# EAGLE design string_lights_revA (EAGLE 7.3.0)
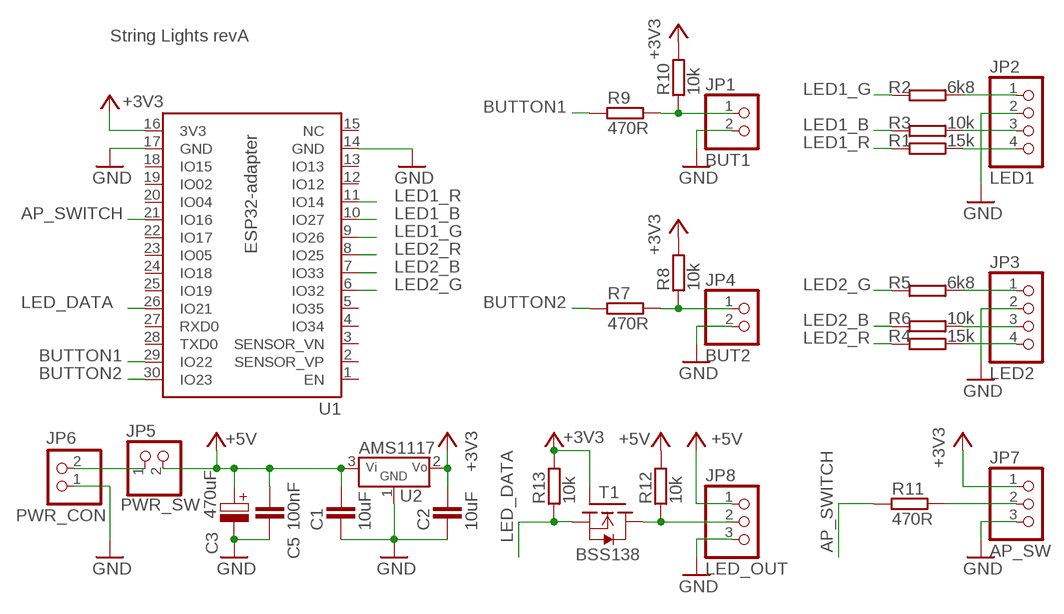
[diagram p0: schematic, sheet 1]

## Parts
C1  10uF  C-CERAMIC'SMD'  [C0805]
C2  10uF  C-CERAMIC'SMD'  [C0805]
C3  470uF  C-POLY'10MM'  [ELYT-10MM]
C5  100nF  C-CERAMIC'SMD'  [C0805]
JP1  BUT1  PINHD-1X2/90  [1X02/90]
JP2  LED1  PINHD-1X4/90  [1X04/90]
JP3  LED2  PINHD-1X4/90  [1X04/90]
JP4  BUT2  PINHD-1X2/90  [1X02/90]
JP5  PWR_SW  PINHD-1X2/90  [1X02/90]
JP6  PWR_CON  PINHD-1X2/90  [1X02/90]
JP7  AP_SW  PINHD-1X3/90  [1X03/90]
JP8  LED_OUT  PINHD-1X3/90  [1X03/90]
R1  15k  R'2'  [R0805]
R2  6k8  R'2'  [R0805]
R3  10k  R'2'  [R0805]
R4  15k  R'2'  [R0805]
R5  6k8  R'2'  [R0805]
R6  10k  R'2'  [R0805]
R7  470R  R'2'  [R0805]
R8  10k  R'2'  [R0805]
R9  470R  R'2'  [R0805]
R10  10k  R'2'  [R0805]
R11  470R  R'2'  [R0805]
R12  10k  R'2'  [R0805]
R13  10k  R'2'  [R0805]
T1  BSS138  [SOT23]
U1  ESP32-ADAPTER  [ESP32-ADAPTER]
U2  AMS1117  V_STAB'TS1117'  [SOT223]

## Nets
+3V3: C2.2 JP7.1 R8.2 R10.2 R13.2 T1.1(G) U1.16(3V3) U2.2(VOUT)
+5V: C1.2 C3.P(POS) C5.2 JP5.2 JP8.1 R12.2 U2.3(VIN)
AP_SWITCH: R11.1 U1.21(IO16)
BUTTON1: R9.1 U1.29(IO22)
BUTTON2: R7.1 U1.30(IO23)
GND: C1.1 C2.1 C3.N(NEG) C5.1 JP1.2 JP2.2 JP3.2 JP4.2 JP6.1 JP7.3 JP8.3 U1.14(GND) U1.17(GND) U2.1(GND)
LED1_B: R3.1 U1.10(IO27)
LED1_G: R2.1 U1.9(IO26)
LED1_R: R1.1 U1.11(IO14)
LED2_B: R6.1 U1.7(IO33)
LED2_G: R5.1 U1.6(IO32)
LED2_R: R4.1 U1.8(IO25)
LED_DATA: R13.1 T1.2(S) U1.26(IO21)
N$1: JP5.1 JP6.2
N$2: JP2.4 R1.2
N$3: JP2.3 R3.2
N$4: JP2.1 R2.2
N$5: JP3.1 R5.2
N$6: JP3.3 R6.2
N$7: JP3.4 R4.2
N$8: JP4.1 R7.2 R8.1
N$9: JP1.1 R9.2 R10.1
N$10: JP7.2 R11.2
N$12: JP8.2 R12.1 T1.3(D)
Unconnected: U1.1(EN) U1.2(SENSOR_VP) U1.3(SENSOR_VN) U1.4(IO34) U1.5(IO35) U1.12(IO12) U1.13(IO13) U1.15(NC) U1.18(IO15) U1.19(IO02) U1.20(IO04) U1.22(IO17) U1.23(IO05) U1.24(IO18) U1.25(IO19) U1.27(RXD0) U1.28(TXD0)

## Notes on the sheet
- String Lights revA

## Library data of the parts
C1 C2 C5 = 1_domaci:C-CERAMIC
C3 = 1_domaci:C-POLY
JP1 JP4-JP6 = pinhead:PINHD-1X2: PIN HEADER
JP2 JP3 = pinhead:PINHD-1X4: PIN HEADER
JP7 JP8 = pinhead:PINHD-1X3: PIN HEADER
R1-R13 = 1_domaci:R
T1 = 1_domaci:BSS138
U1 = 1_domaci:ESP32-ADAPTER
U2 = 1_domaci:V_STAB

## Board
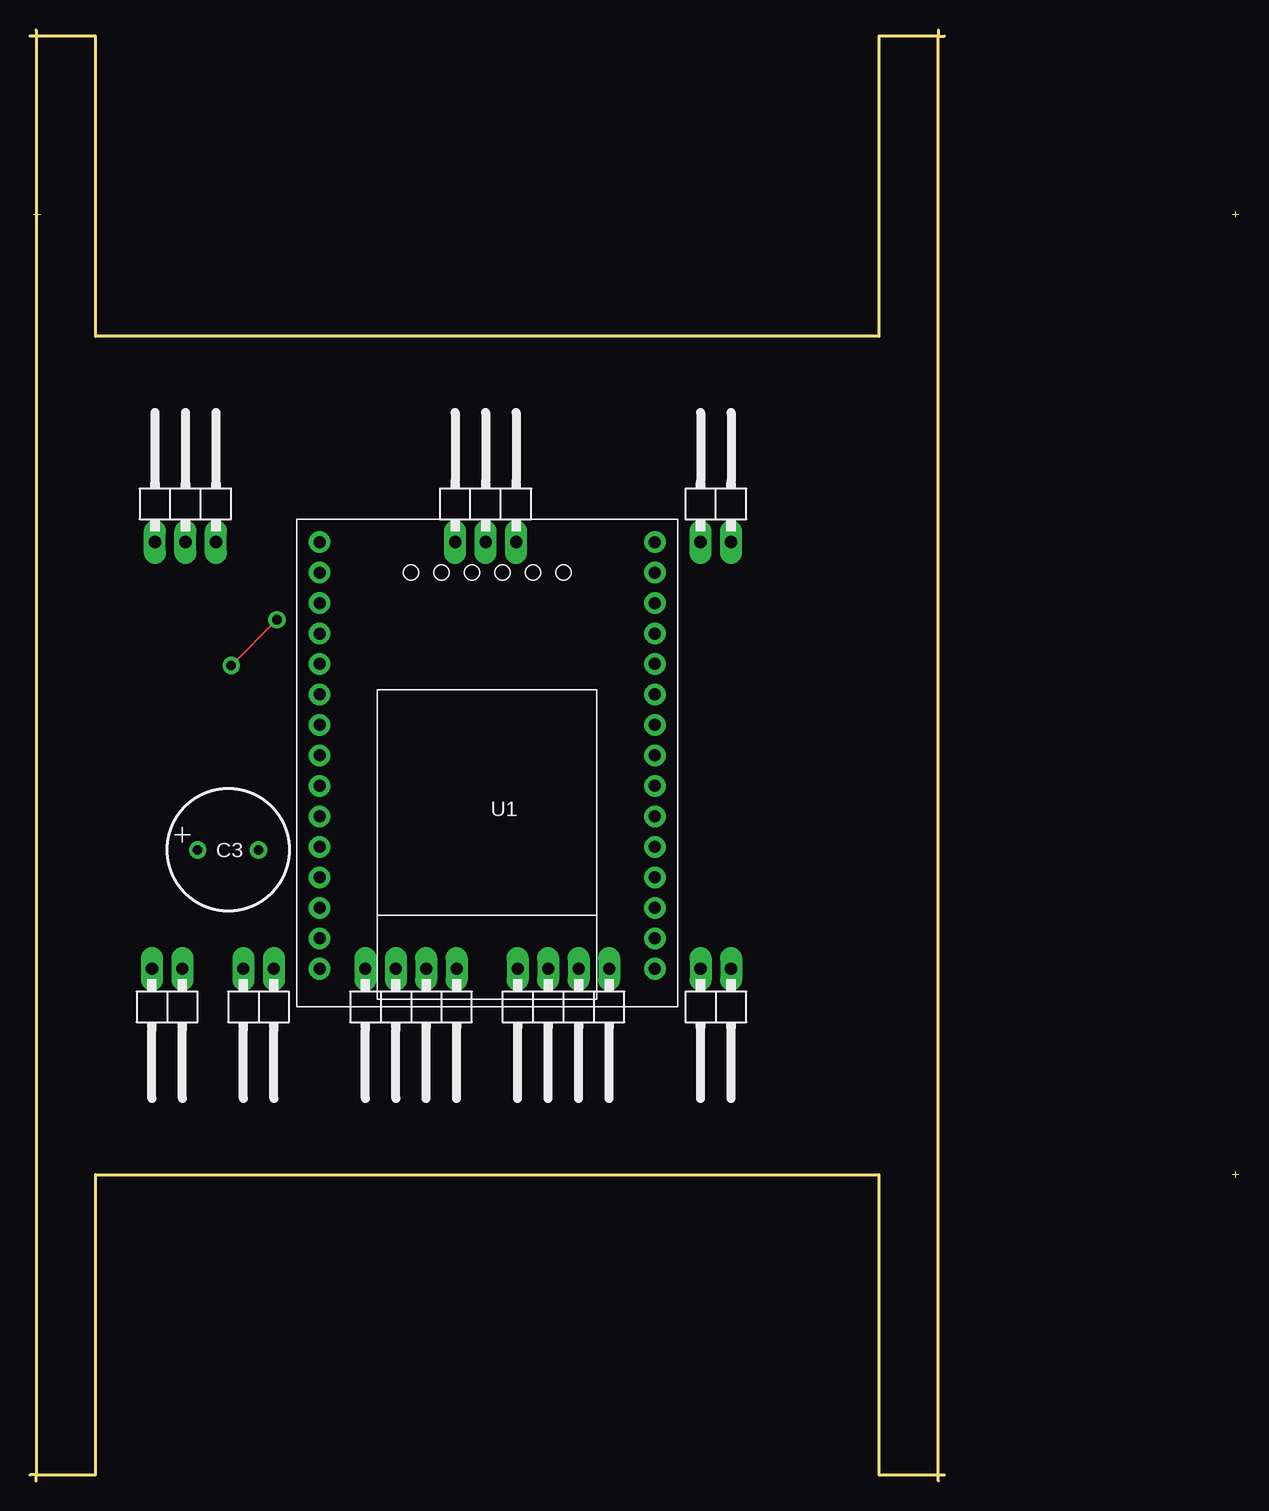
[diagram p1: board, top side]
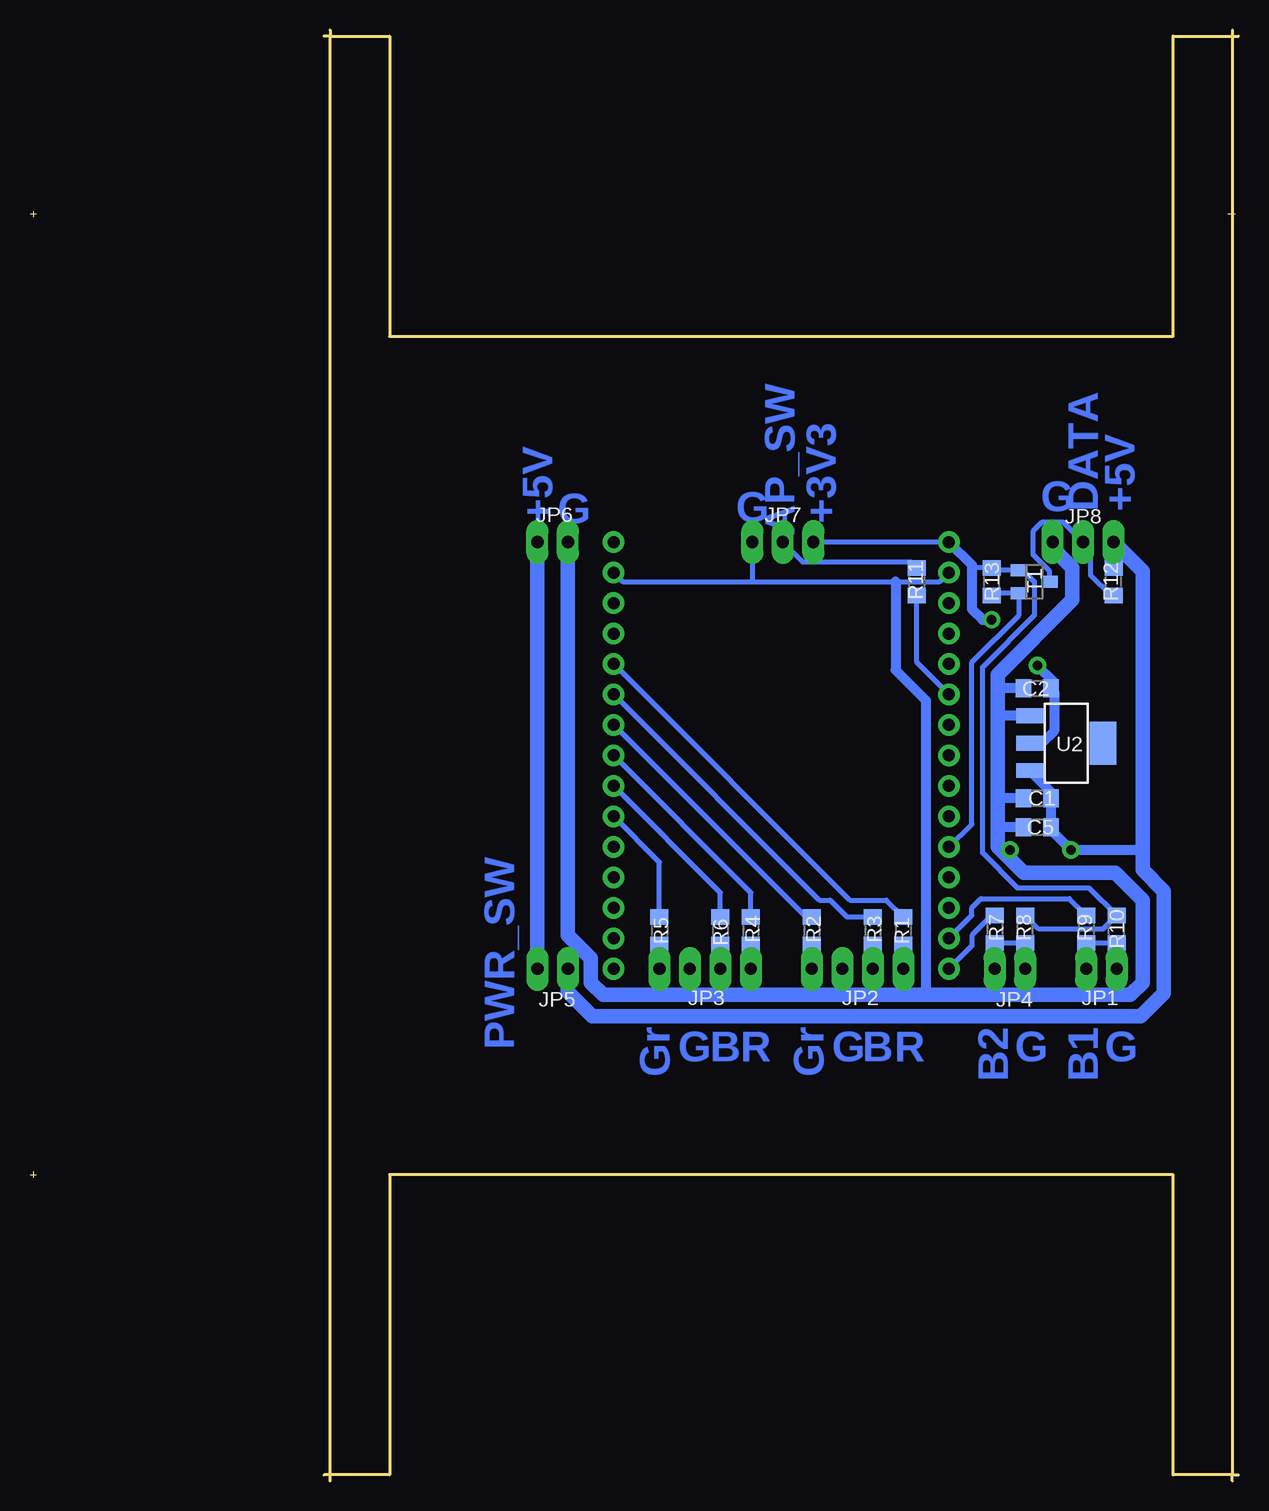
[diagram p2: board, bottom side, seen from below]

Size 100.71 x 120.9 mm. Coordinates in mm from the lower left corner, seen from the top.
Outline: 75.69,0.51 75.69,120.4
Outline: 0.51,120.4 0.51,0.51
Outline: 0.51,0.51 5.46,0.51 5.46,25.53 70.74,25.53 70.74,0.51 75.69,0.51
Outline: 0.51,120.4 5.46,120.4 5.46,95.38 70.74,95.38 70.74,120.4 75.69,120.4
Outline: 100.2,105.54 100.71,105.54
Outline: 100.46,105.79 100.46,105.28
Outline: 100.46,25.78 100.46,25.27
Outline: 100.71,25.53 100.2,25.53
Outline: 0.25,105.54 0.89,105.54
Outline: 0.51,120.4 0,120.4
Outline: 0.51,120.9 0.51,120.4
Outline: 75.69,120.9 75.69,120.4
Outline: 75.69,120.4 76.2,120.4
Outline: 75.69,0.51 76.2,0.51
Outline: 75.69,0 75.69,0.51
Outline: 0.51,0 0.51,0.51
Outline: 0.51,0.51 0,0.51
Copper layers (1*16): Top 0.035mm / dielectric 1.5mm / Bottom 0.035mm
Design rules "default *": minimum track width 10mil, minimum drill 24mil, track to track 8mil, track to pad 8mil, pad to pad 8mil, via to via 8mil, smd to smd 8mil, copper to edge 40mil, drill to drill 8mil, minimum pad ring 10mil, minimum via ring 8mil, stop-mask expansion 4mil, vias tented up to drill 0mil, thermal gap 10mil

### Footprints (pad centres in the part's own frame; a part is rotated, then mirrored left to right if it is on the bottom)
C0805 = smd 1.3 x 1.5: 1 -1.143,0; 2 1.143,0
ELYT-10MM = drill 0.8: N 2.54,0; P -2.54,0
1X02/90 = drill 1.016 long: 1 -1.27,-3.81; 2 1.27,-3.81
1X04/90 = drill 1.016 long: 1 -3.81,-3.81; 2 -1.27,-3.81; 3 1.27,-3.81; 4 3.81,-3.81
1X03/90 = drill 1.016 long: 1 -2.54,-3.81; 2 0,-3.81; 3 2.54,-3.81
R0805 = smd 1.3 x 1.5: 1 -1.143,0; 2 1.143,0
SOT23 = smd 1 x 1.4: 1 -0.953,-1.27; 2 0.953,-1.27; 3 0,1.27
ESP32-ADAPTER = drill 1: 1 -13.97,17.78; 2 -13.97,15.24; 3 -13.97,12.7; 4 -13.97,10.16; 5 -13.97,7.62; 6 -13.97,5.08; 7 -13.97,2.54; 8 -13.97,0; 9 -13.97,-2.54; 10 -13.97,-5.08; 11 -13.97,-7.62; 12 -13.97,-10.16; 13 -13.97,-12.7; 14 -13.97,-15.24; 15 -13.97,-17.78; 16 13.97,-17.78; 17 13.97,-15.24; 18 13.97,-12.7; 19 13.97,-10.16; 20 13.97,-7.62; 21 13.97,-5.08; 22 13.97,-2.54; 23 13.97,0; 24 13.97,2.54; 25 13.97,5.08; 26 13.97,7.62; 27 13.97,10.16; 28 13.97,12.7; 29 13.97,15.24; 30 13.97,17.78
SOT223 = smd 1.219 x 2.235: 1 -2.286,-3.048; 2 0,-3.048; 3 2.286,-3.048 | smd 3.6 x 2.2: 4 0,3.048

### Placement (x,y rotation side)
C1  16.76,56.9 0 bottom
C2  16.76,66.04 0 bottom
C3  16.51,52.58 0 top
C5  16.76,54.48 0 bottom
JP1  11.43,38.86 180 top
JP2  31.75,38.86 180 top
JP3  44.45,38.86 180 top
JP4  19.05,38.86 180 top
JP5  57.15,38.86 180 top
JP6  57.15,82.04 0 top
JP7  37.97,82.04 0 top
JP8  12.95,82.04 0 top
R1  27.94,45.85 270 bottom
R2  35.56,45.85 270 bottom
R3  30.48,45.85 270 bottom
R4  40.64,45.85 270 bottom
R5  48.26,45.85 270 bottom
R6  43.18,45.85 270 bottom
R7  20.32,45.97 270 bottom
R8  17.78,45.97 90 bottom
R9  12.7,45.97 270 bottom
R10  10.16,45.97 90 bottom
R11  26.8,74.93 90 bottom
R12  10.41,74.93 90 bottom
R13  20.57,74.93 90 bottom
T1  17.02,74.93 270 bottom
U1  38.1,60.45 180 top
U2  14.35,61.47 270 bottom

### Tracks (layer width: path | path; a pad name or v marks a point on that pad's centre or on a via)
+3V3  (via drill 0.8)
  Top 0.127: v16.76,67.94 v20.57,71.75
  Bottom 0.406: U1.16 JP7.1 | R8.2 16.64,45.97 11.3,45.97 R10.2 12.45,49.4 18.41,49.4 21.34,52.32 21.34,67.82 17.02,72.14 17.02,74.93 17.97,75.88 T1.1 20.38,75.88 R13.2 22.22,76.07
  Bottom 0.813: v16.76,67.94 15.37,66.55 15.37,66.04 C2.2 15.37,65.79 15.37,62.48 16.38,61.47 U2.2 | U1.16 22.22,76.33 22.22,76.07 22.22,72.64 21.34,71.75 v20.57,71.75
+5V
  Bottom 0.406: R12.2 9.33,77.15
  Bottom 0.813: U2.3 15.62,57.4 C1.2 C5.2 15.62,54.23 C3.P 8,52.58
  Bottom 1.219: JP5.2 55.88,40.77 53.85,38.73 8.13,38.73 6.22,40.64 6.22,49.15 8,50.93 8,52.58 8,75.82 9.33,77.15 JP8.1
AP_SWITCH
  Bottom 0.406: U1.21 26.8,68.2 R11.1
BUTTON1
  Bottom 0.406: U1.29 22.22,47.12 22.22,47.75 21.46,48.51 14.1,48.51 R9.1
BUTTON2
  Bottom 0.406: R7.1 20.57,47.12 22.22,45.47 22.22,44.58 U1.30
GND
  Bottom 0.406: U1.14 51.31,74.93 40.51,74.93 | 40.51,74.93 28.57,74.93 24.89,74.93 U1.17 | JP7.3 40.51,74.93 | JP1.2 10.16,40.51 | JP4.2 17.78,40.51 | JP2.2 33.02,40.51 | JP3.2 45.72,40.51
  Bottom 0.813: 26.04,40.51 26.04,65.02 28.57,67.56 28.57,74.93 | C1.1 20.07,56.9 | C5.1 20.07,54.48 | C2.1 20.07,66.04 | U2.1 20.07,63.75 | C3.N 19.43,52.2
  Bottom 1.219: JP6.1 55.88,45.47 53.98,43.56 53.98,41.53 52.96,40.51 45.72,40.51 33.02,40.51 26.04,40.51 17.78,40.51 10.16,40.51 9.02,40.51 8,41.53 8,48.39 10.29,50.67 17.91,50.67 19.43,52.2 20.07,52.83 20.07,54.48 20.07,56.9 20.07,63.75 20.07,66.04 20.07,67.18 13.84,73.41 13.84,76.07 15.49,77.72 JP8.3
LED1_B
  Bottom 0.406: U1.10 34.93,48.39 34.04,48.39 32.64,46.99 R3.1
LED1_G
  Bottom 0.406: R2.1 36.07,46.99 U1.9
LED1_R
  Bottom 0.406: U1.11 32.38,48.39 29.34,48.39 R1.1
LED2_B
  Bottom 0.406: R6.1 43.18,49.02 U1.7
LED2_G
  Bottom 0.406: R5.1 48.26,51.56 U1.6
LED2_R
  Bottom 0.406: R4.1 40.64,49.02 U1.8
LED_DATA
  Bottom 0.406: U1.26 22.22,54.74 22.22,68.2 18.29,72.14 T1.2 20.38,73.98 R13.1
N$1
  Bottom 1.219: JP6.2 JP5.1
N$2
  Bottom 0.406: JP2.4 R1.2
N$3
  Bottom 0.406: JP2.3 R3.2
N$4
  Bottom 0.406: JP2.1 R2.2
N$5
  Bottom 0.406: JP3.1 R5.2
N$6
  Bottom 0.406: R6.2 JP3.3
N$7
  Bottom 0.406: JP3.4 R4.2
N$8
  Bottom 0.406: JP4.1 R7.2 R8.1
N$9
  Bottom 0.406: JP1.1 R9.2 R10.1
N$10
  Bottom 0.406: JP7.2 36.32,76.58 27.3,76.58 R11.2
N$12
  Bottom 0.406: R12.1 10.67,73.79 12.32,75.44 12.32,77.6 JP8.2 14.61,79.88 16.38,79.88 17.14,79.12 17.14,77.22 15.75,75.82 T1.3

### Text on the board
Bottom: AP_SW | +5V | DATA | G | +3V3 | G | G | +5V | PWR_SW | G | G | R | B | G | R | B | G | B1 | B2 | Gr | Gr